# Altium schematic sheet IO.SchDoc: SR4K_PHY6222_LED
size A4; Revision: V1.2; SheetNumber: 5; SheetTotal: 5
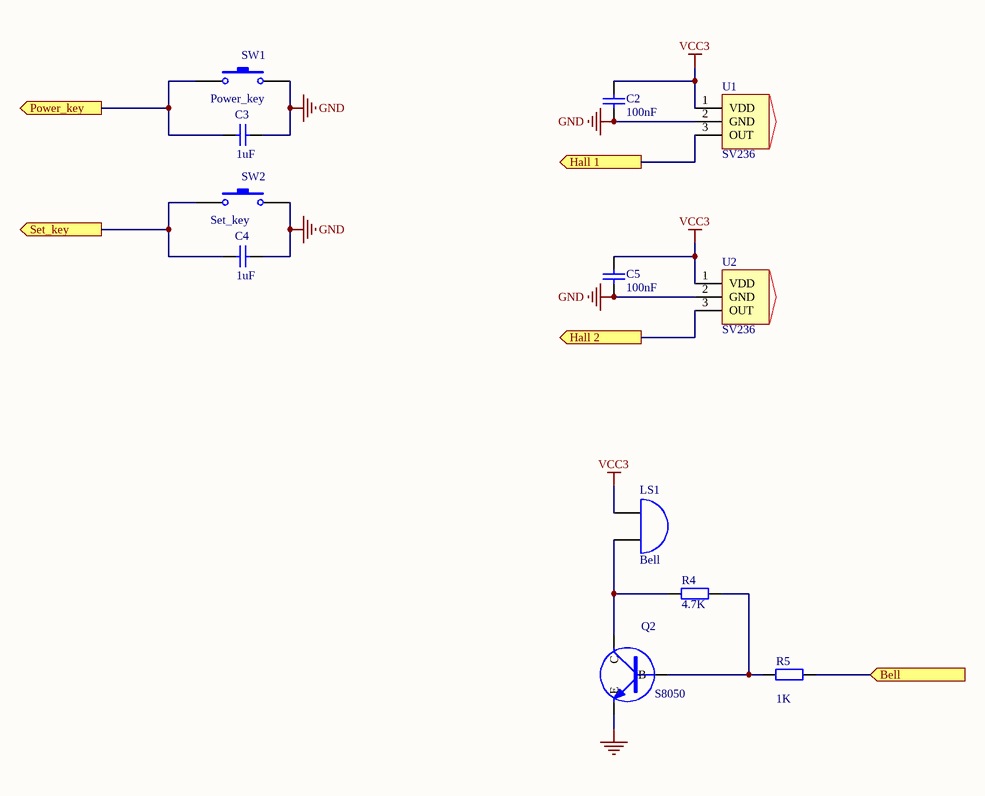
[diagram p0: IO.SchDoc]

## Parts
C2  value 100nF  [RAD-0.3]  (hidden comment: Cap)
C3  value 1uF  (hidden comment: Cap)
C4  value 1uF  (hidden comment: Cap)
C5  value 100nF  [RAD-0.3]  (hidden comment: Cap)
LS1  Bell
Q2  S8050  [SOT-23]
R4  value 4.7K  (hidden comment: 100K)
R5  value 1K  (hidden comment: Res2)
SW1  Power_key
SW2  Set_key
U1  SV236  [sot-23-3]
U2  SV236  [sot-23-3]

## Ports
Bell (in), Hall 1 (out), Hall 2 (out), Power_key (out), Set_key (out)

## Nets
GND: C2.2 C3.1 C4.1 C5.2 Q2.2(E) SW1.2 SW2.2 U1.2(GND) U2.2(GND)
VCC3: C2.1 C5.1 LS1.1(A) U1.1(VDD) U2.1(VDD)
Bell: R5.2 ; port Bell
Hall 1: U1.3(OUT) ; port Hall 1
Hall 2: U2.3(OUT) ; port Hall 2
Power_key: C3.2 SW1.1 ; port Power_key
Set_key: C4.2 SW2.1 ; port Set_key
NetLS1_2: LS1.2(B) Q2.3(C) R4.2
NetQ2_1: Q2.1(B) R4.1 R5.1

## Notes on the sheet
- Title
- Size:
- Date:
- A4
- Number:
- Time:
- Revision:
- Sheet
- emmovo@outlook.com
- of
- File:

## Library data of the parts
C2-C5 = Cap: Capacitor; Published: 8-Jun-2000; LatestRevisionDate: 17-Jul-2002; LatestRevisionNote: Re-released for DXP Platform.; PackageReference: RAD-0.3; Publisher: Altium Limited; PackageDescription: Radial Cap, Thru-Hole; 2 Leads; 0.3 in Pin Spacing
LS1 = Bell: Electrical Bell; Published: 24-Mar-1999; LatestRevisionDate: 17-Jul-2002; LatestRevisionNote: Re-released for DXP Platform.; PackageReference: PIN2; Publisher: Altium Limited
Q2 = NPN: NPN Transistor
R4 R5 = Res2: Resistor; Published: 8-Jun-2000; LatestRevisionDate: 17-Jul-2002; LatestRevisionNote: Re-released for DXP Platform.; PackageReference: AXIAL-0.4; Publisher: Altium Limited; PackageDescription: Axial Device, Thru-Hole; 2 Leads; 0.4 in Pin Spacing
SW1 SW2 = SW-PB: Switch; Published: 24-Mar-1999; LatestRevisionDate: 17-Jul-2002; LatestRevisionNote: Re-released for DXP Platform.; PackageReference: SPST-2; Publisher: Altium Limited
U1 U2 = 霍尔44E 938